# Altium schematic sheet InputModule.SchDoc
size A4
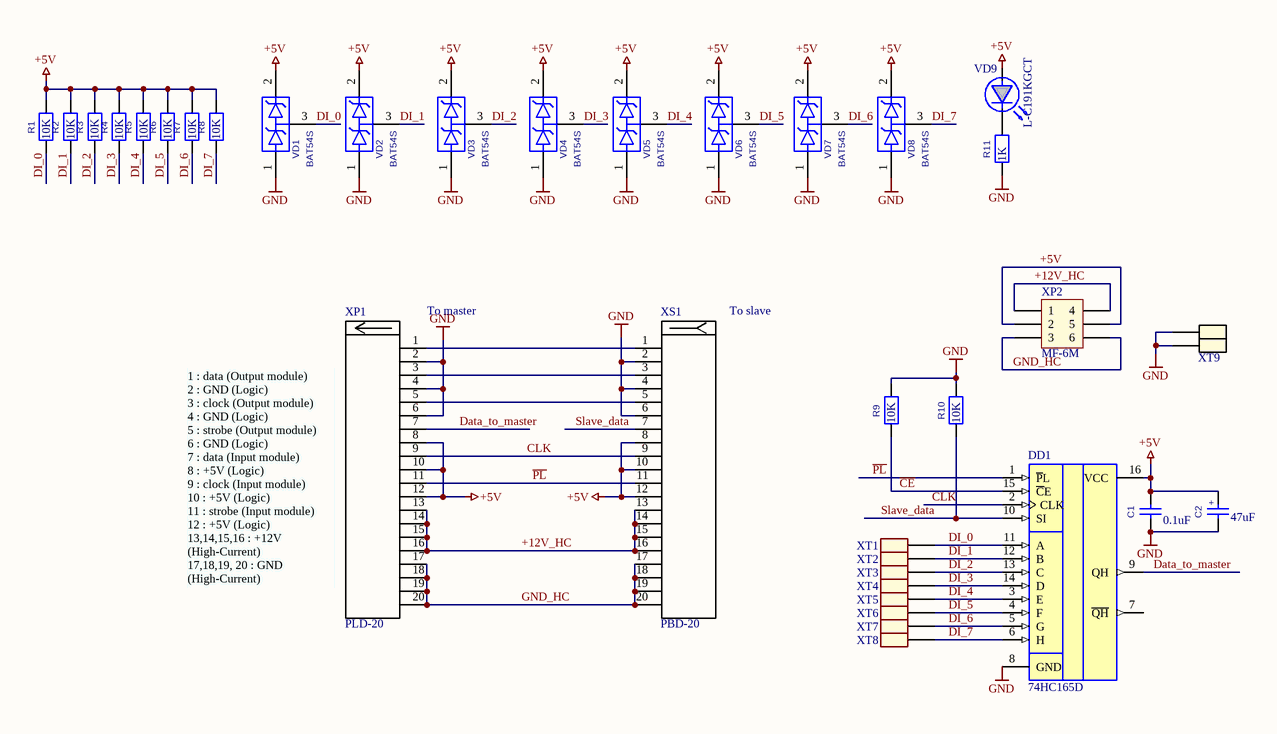
[diagram p0: InputModule.SchDoc]

## Parts
C1  0.1uF  [C-1608[0603]]
C2  47uF  [C-CASE]
DD1  74HC165D  [SO-G16]
R1  10K  [R-1608[0603]]
R2  10K  [R-1608[0603]]
R3  10K  [R-1608[0603]]
R4  10K  [R-1608[0603]]
R5  10K  [R-1608[0603]]
R6  10K  [R-1608[0603]]
R7  10K  [R-1608[0603]]
R8  10K  [R-1608[0603]]
R9  10K  [R-1608[0603]]
R10  10K  [R-1608[0603]]
R11  1K  [R-1608[0603]]
VD1  BAT54S  [SOT-23]
VD2  BAT54S  [SOT-23]
VD3  BAT54S  [SOT-23]
VD4  BAT54S  [SOT-23]
VD5  BAT54S  [SOT-23]
VD6  BAT54S  [SOT-23]
VD7  BAT54S  [SOT-23]
VD8  BAT54S  [SOT-23]
VD9  L-C191KGCT  [LED-0603]
XP1  PLD-20  [PLD-20 ROT]
XP2  MF-6M  [MF-6M]
XS1  PBD-20  [PBD-20 Rot]
XT1  DG141V-01P  [DG141V-01P (XY123R)]  (value not drawn)
XT2  DG141V-01P  [DG141V-01P (XY123R)]  (value not drawn)
XT3  DG141V-01P  [DG141V-01P (XY123R)]  (value not drawn)
XT4  DG141V-01P  [DG141V-01P (XY123R)]  (value not drawn)
XT5  DG141V-01P  [DG141V-01P (XY123R)]  (value not drawn)
XT6  DG141V-01P  [DG141V-01P (XY123R)]  (value not drawn)
XT7  DG141V-01P  [DG141V-01P (XY123R)]  (value not drawn)
XT8  DG141V-01P  [DG141V-01P (XY123R)]  (value not drawn)
XT9  1-1776244-0 (TYCO)  [1-1776244-0]  (value not drawn)

## Nets
+5V: C1.1 C2.1(+) DD1.16(VCC) R1.2 R2.2 R3.2 R4.2 R5.2 R6.2 R7.2 R8.2 VD1.2(c) VD2.2(c) VD3.2(c) VD4.2(c) VD5.2(c) VD6.2(c) VD7.2(c) VD8.2(c) VD9.2(A) XP1.8 XP1.10 XP1.12 XP2.2 XP2.5 XS1.8 XS1.10 XS1.12
GND: C1.2 C2.2(-) DD1.8(GND) R9.2 R10.2 R11.1 VD1.1(a) VD2.1(a) VD3.1(a) VD4.1(a) VD5.1(a) VD6.1(a) VD7.1(a) VD8.1(a) XP1.2 XP1.4 XP1.6 XS1.2 XS1.4 XS1.6 XT9.1 XT9.2
+12V_HC: XP1.13 XP1.14 XP1.15 XP1.16 XP2.1 XP2.4 XS1.13 XS1.14 XS1.15 XS1.16
~{CE}: DD1.15(~{C}E) R9.1
CLK: DD1.2(CLK) XP1.9 XS1.9
Data_to_master: DD1.9(QH) XP1.7
DI_0: DD1.11(A) R1.1 VD1.3(ka) XT1.1
DI_1: DD1.12(B) R2.1 VD2.3(ka) XT2.1
DI_2: DD1.13(C) R3.1 VD3.3(ka) XT3.1
DI_3: DD1.14(D) R4.1 VD4.3(ka) XT4.1
DI_4: DD1.3(E) R5.1 VD5.3(ka) XT5.1
DI_5: DD1.4(F) R6.1 VD6.3(ka) XT6.1
DI_6: DD1.5(G) R7.1 VD7.3(ka) XT7.1
DI_7: DD1.6(H) R8.1 VD8.3(ka) XT8.1
GND_HC: XP1.17 XP1.18 XP1.19 XP1.20 XP2.3 XP2.6 XS1.17 XS1.18 XS1.19 XS1.20
~{PL}: DD1.1(~{P}L) XP1.11 XS1.11
Slave_data: DD1.10(SI) R10.1 XS1.7
NetR11_2: R11.2 VD9.1(K)
NetXP1_1: XP1.1 XS1.1
NetXP1_3: XP1.3 XS1.3
NetXP1_5: XP1.5 XS1.5

Not connected (* = marked no-connect by the designer): DD1 7(~{QH})

## Notes on the sheet
- (near XP1) To master
- (near XS1) To slave
- 1 : data (Output module)
  2 : GND (Logic)
  3 : clock (Output module)
  4 : GND (Logic)
  5 : strobe (Output module)
  6 : GND (Logic)
  7 : data (Input module)
  8 : +5V (Logic)
  9 : clock (Input module)
  10 : +5V (Logic)
  11 : strobe (Input module)
  12 : +5V (Logic)
  13,14,15,16 : +12V (High-Current)
  17,18,19, 20 : GND (High-Current)

## Library data of the parts
C1 = C-0603: Value: 0.1uF
C2 = C-CCASE: Value: 47uF
DD1 = 74HC165D: 8-Bit Parallel-Load Shift Register; Value: *
R1-R11 = R-0603
  R1-R10: Value: 10K
  R11: Value: 1K
VD1-VD8 = BAT54S: Schottky barrier (double) diodes
VD9 = L-C191KGCT: 0603 Green Led
XP1 = PLD-20: 20 pin, 2 row, MALE connector
XP2 = MF-6M: Molex Male connector
XS1 = PBD-20: 2.54mm, 20 pin FEMALE connector
XT1-XT8 = DG141V-01P: Клеммник нажимной 2.54мм
XT9 = 1-1776244-0 (TYCO): Винтовой клеммник 5.0мм